# EAGLE design mds (EAGLE 7.3.0)
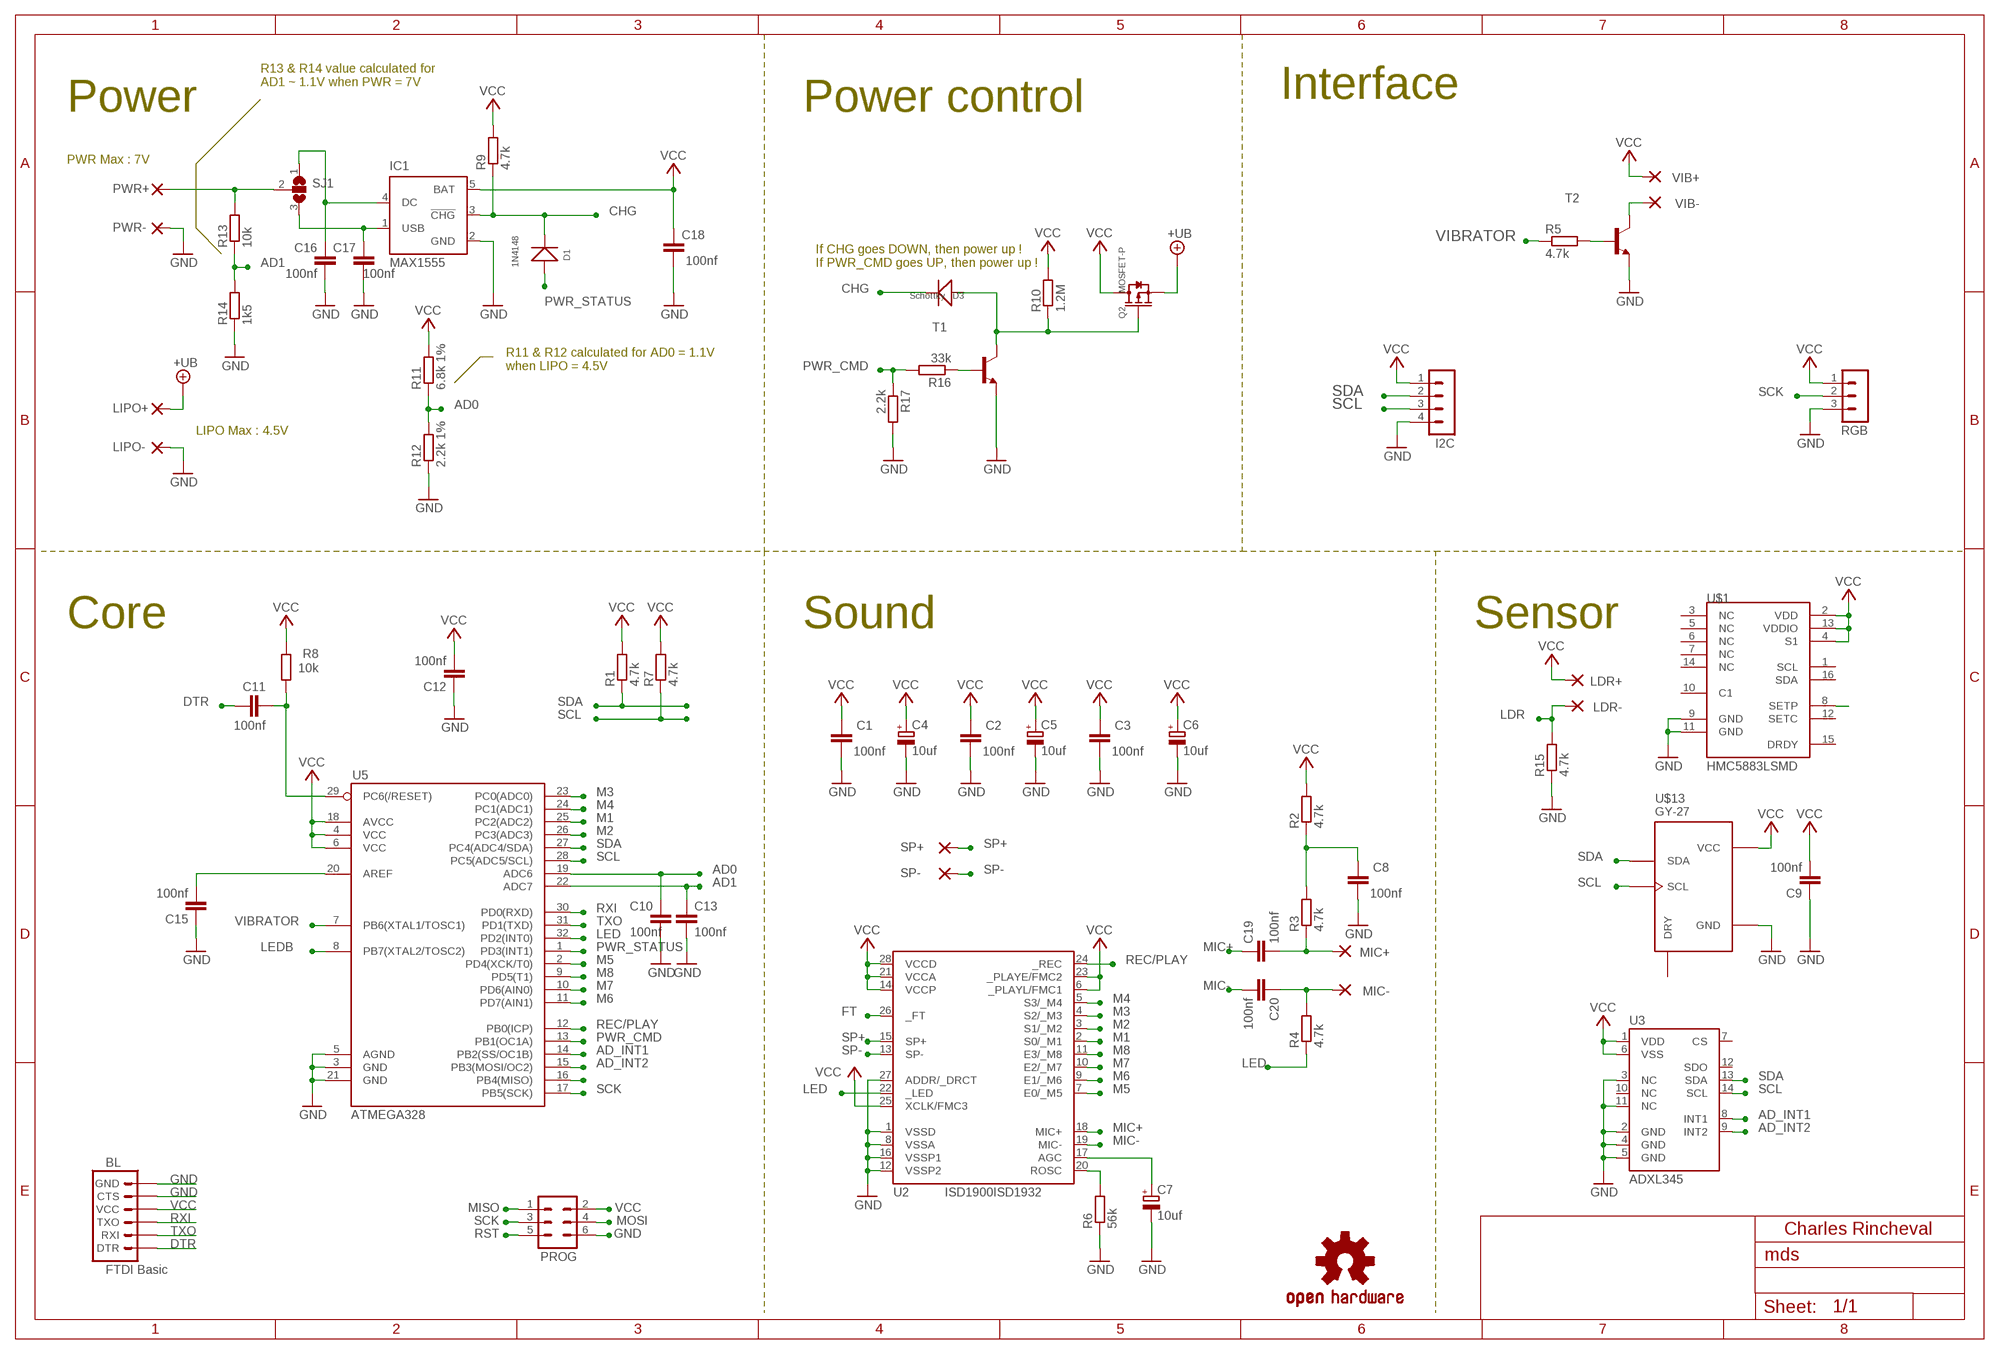
[diagram p0: schematic, sheet 1]

## Parts
BL  FTDI Basic  ARDUINO_SERIAL_PROGRAMPTH  [1X06]
C1  100nf  C-EUC0805  [C0805]
C2  100nf  C-EUC0805  [C0805]
C3  100nf  C-EUC0805  [C0805]
C4  10uf  CPOL-EUCT3528  [CT3528]
C5  10uf  CPOL-EUCT3528  [CT3528]
C6  10uf  CPOL-EUCT3528  [CT3528]
C7  10uf  CPOL-EUCT3528  [CT3528]
C8  100nf  C-EUC0805  [C0805]
C9  100nf  C-EUC0805  [C0805]
C10  100nf  C-EUC0805  [C0805]
C11  100nf  C-EUC0805  [C0805]
C12  100nf  C-EUC0805  [C0805]
C13  100nf  C-EUC0805  [C0805]
C15  100nf  C-EUC0805  [C0805]
C16  100nf  C-EUC0805  [C0805]
C17  100nf  C-EUC0805  [C0805]
C18  100nf  C-EUC0805  [C0805]
C19  100nf  C-EUC0805  [C0805]
C20  100nf  C-EUC0805  [C0805]
D1  1N4148  D-D1206  [LL-34]
D3  Schottky  D-D1206  [LL-34]
I2C  MA04-1  [MA04-1]
IC1  MAX1555  [SOT23-5L]
LDR+  1,6/0,8  [1,6/0,8]
LDR-  1,6/0,8  [1,6/0,8]
LIPO+  1,6/0,8  [1,6/0,8]
LIPO-  1,6/0,8  [1,6/0,8]
MIC+  1,6/0,8  [1,6/0,8]
MIC-  1,6/0,8  [1,6/0,8]
PROG  MA03-2  [MA03-2]
PWR+  1,6/0,8  [1,6/0,8]
PWR-  1,6/0,8  [1,6/0,8]
Q2  MOSFET-P  MOSFET-P-044021001  [SOT23]
R1  4.7k  R-EU_M0805  [M0805]
R2  4.7k  R-EU_M0805  [M0805]
R3  4.7k  R-EU_M0805  [M0805]
R4  4.7k  R-EU_M0805  [M0805]
R5  4.7k  R-EU_M0805  [M0805]
R6  56k  R-EU_M0805  [M0805]
R7  4.7k  R-EU_M0805  [M0805]
R8  10k  R-EU_M0805  [M0805]
R9  4.7k  R-EU_M0805  [M0805]
R10  1.2M  R-EU_M0805  [M0805]
R11  6.8k 1%  R-EU_M0805  [M0805]
R12  2.2k 1%  R-EU_M0805  [M0805]
R13  10k  R-EU_M0805  [M0805]
R14  1k5  R-EU_M0805  [M0805]
R15  4.7k  R-EU_M0805  [M0805]
R16  33k  R-EU_M0805  [M0805]
R17  2.2k  R-EU_M0805  [M0805]
RGB  MA03-1  [MA03-1]
SJ1  SJ2W  [SJ_2]
SP+  1,6/0,8  [1,6/0,8]
SP-  1,6/0,8  [1,6/0,8]
T1  MMBT2222ALT1-NPN-SOT23-BEC  [SOT23-BEC]
T2  MMBT2222ALT1-NPN-SOT23-BEC  [SOT23-BEC]
U2  ISD1900ISD1932  [SO-28W]
U3  ADXL345  [LGA14]
U5  ATMEGA328  ATMEGA168  [TQFP32-08]
U$1  HMC5883LSMD  [16LPCC]
U$13  GY-27  [GY-27]
U$14  OSHW-LOGOS  [OSHW-LOGO-S]
VIB+  1,6/0,8  [1,6/0,8]
VIB-  1,6/0,8  [1,6/0,8]

## Nets
+UB: LIPO+.1(P) Q2.2(S)
AD0: C10.1 R11.1 R12.2 U5.19(ADC6)
AD1: C13.1 R13.1 R14.2 U5.22(ADC7)
AD_INT1: U3.8(INT1) U5.14(PB2(SS/OC1B))
AD_INT2: U3.9(INT2) U5.15(PB3(MOSI/OC2))
AGC: C7.+ U2.17(AGC)
AREF: C15.2 U5.20(AREF)
CHG: D1.C(-) D3.C(-) IC1.3(!CHG) R9.1
DTR: BL.1(DTR) C11.1
FT: U2.26(_FT)
GND: BL.5(CTS) BL.6(GND) C1.1 C2.1 C3.1 C4.- C5.- C6.- C7.- C8.1 C9.1 C10.2 C12.1 C13.2 C15.1 C16.1 C17.1 C18.1 I2C.4 IC1.2(GND) LIPO-.1(P) PROG.6 PWR-.1(P) R6.1 R12.1 R14.1 R15.1 R17.2 RGB.3 T1.E T2.E U2.1(VSSD) U2.8(VSSA) U2.12(VSSP2) U2.16(VSSP1) U2.27(ADDR/_DRCT) U3.2(GND) U3.3(NC) U3.4(GND) U3.5(GND) U3.11(NC) U5.3(GND) U5.5(AGND) U5.21(GND) U$1.9(GND) U$1.11(GND) U$13.GND
LDR: LDR-.1(P) R15.2
LED: R4.1 U2.22(_LED) U5.32(PD2(INT0))
LEDB: U5.8(PB7(XTAL2/TOSC2))
M1: U2.2(S0/_M1) U5.25(PC2(ADC2))
M2: U2.3(S1/_M2) U5.26(PC3(ADC3))
M3: U2.4(S2/_M3) U5.23(PC0(ADC0))
M4: U2.5(S3/_M4) U5.24(PC1(ADC1))
M5: U2.7(E0/_M5) U5.2(PD4(XCK/T0))
M6: U2.9(E1/_M6) U5.11(PD7(AIN1))
M7: U2.10(E2/_M7) U5.10(PD6(AIN0))
M8: U2.11(E3/_M8) U5.9(PD5(T1))
MIC+: C19.1 U2.18(MIC+)
MIC-: C20.2 U2.19(MIC-)
MISO: PROG.1
MOSI: PROG.4
N$1: R6.2 U2.20(ROSC)
N$2: C19.2 MIC+.1(P) R3.1
N$3: C20.1 MIC-.1(P) R4.2
N$4: R16.1 T1.B
N$5: R5.2 T2.B
N$6: C8.2 R2.1 R3.2
N$7: T2.C VIB-.1(P)
N$8: PWR+.1(P) R13.2 SJ1.2
N$9: Q2.1(G) R10.1 T1.C
N$11: C17.2 IC1.1(USB) SJ1.3
N$12: C16.2 IC1.4(DC) SJ1.1
N$13: U5.16(PB4(MISO))
N$14: U$1.8(SETP)
PWR_CMD: R16.2 R17.1 U5.13(PB1(OC1A))
PWR_STATUS: D1.A(+) U5.1(PD3(INT1))
REC/PLAY: U2.24(_REC) U5.12(PB0(ICP))
RST: C11.2 PROG.5 R8.1 U5.29(PC6(/RESET))
RXI: BL.3(TXO) U5.30(PD0(RXD))
SCK: PROG.3 RGB.2 U5.17(PB5(SCK))
SCL: I2C.3 R7.1 U3.14(SCL) U5.28(PC5(ADC5/SCL)) U$13.SCL
SDA: I2C.2 R1.1 U3.13(SDA) U5.27(PC4(ADC4/SDA)) U$13.SDA
SP+: SP+.1(P) U2.15(SP+)
SP-: SP-.1(P) U2.13(SP-)
TXO: BL.2(RXI) U5.31(PD1(TXD))
VCC: BL.4(VCC) C1.2 C2.2 C3.2 C4.+ C5.+ C6.+ C9.2 C12.2 C18.2 I2C.1 IC1.5(BAT) LDR+.1(P) PROG.2 Q2.3(D) R1.2 R2.2 R7.2 R8.2 R9.2 R10.2 R11.2 RGB.1 U2.6(_PLAYL/FMC1) U2.14(VCCP) U2.21(VCCA) U2.23(_PLAYE/FMC2) U2.25(XCLK/FMC3) U2.28(VCCD) U3.1(VDD) U3.6(VSS) U5.4(VCC) U5.6(VCC) U5.18(AVCC) U$1.2(VDD) U$1.4(S1) U$1.13(VDDIO) U$13.VCC VIB+.1(P)
VIBRATOR: R5.1 U5.7(PB6(XTAL1/TOSC1))
Unconnected: D3.A(+) U3.7(CS) U3.10(NC) U3.12(SDO) U$1.1(SCL) U$1.3(NC) U$1.5(NC) U$1.6(NC) U$1.7(NC) U$1.10(C1) U$1.12(SETC) U$1.14(NC) U$1.15(DRDY) U$1.16(SDA) U$13.DRY

## Notes on the sheet
- R13 & R14 value calculated for
  AD1 ~ 1.1V when PWR = 7V
- Power | Power control | Interface
- PWR Max : 7V
- If CHG goes DOWN, then power up !
  If PWR_CMD goes UP, then power up !
- R11 & R12 calculated for AD0 = 1.1V
  when LIPO = 4.5V
- LIPO Max : 4.5V
- Core | Sound | Sensor
- Charles Rincheval

## Library data of the parts
BL = SparkFun:ARDUINO_SERIAL_PROGRAM
C1-C3 C8-C13 C15-C20 = rcl:C-EU: CAPACITOR, European symbol
C4-C7 = rcl:CPOL-EU: POLARIZED CAPACITOR, European symbol
D1 D3 = OPL Eagle Library:D*: DIODE
I2C = con-lstb:MA04-1: PIN HEADER; OC_FARNELL: unknown; OC_NEWARK: unknown
IC1 = maxim:MAX1555: Dual-Input USB/AC Adapter 1-Cell Li+ Battery Chargers Source: http://www.maxim-ic.com .. MAX1551-MAX1555.pdf; MF: MAXIM; MPN: MAX1555EZK+T; OC_FARNELL: 1628222; OC_NEWARK: 59J2761
LDR+ LDR- LIPO+ LIPO- MIC+ MIC- PWR+ PWR- SP+ SP- VIB+ VIB- = wirepad:1,6/0,8: THROUGH-HOLE PAD
PROG = con-lstb:MA03-2: PIN HEADER; OC_FARNELL: unknown; OC_NEWARK: unknown
Q2 = OPL Eagle Library:MOSFET-P: CJ2305：SMD MOSFET P-CH 8V-4.1A
R1-R17 = rcl:R-EU_: RESISTOR, European symbol
RGB = con-lstb:MA03-1: PIN HEADER; OC_FARNELL: unknown; OC_NEWARK: unknown
SJ1 = jumper:SJ2W: SMD solder JUMPER
T1 T2 = transistor-neu-to92:*-NPN-: NPN Transistror
U2 = SparkFun:ISD1900
U3 = SparkFun-Sensors:ADXL345: 3-axis SPI/I2C 2/4/8/16g accelerometer
U5 = SparkFun:ATMEGA168
U$1 = SparkFun-Sensors:HMC5883L: 3 Axis Digital Compass IC
U$13 = gy-27:GY-27
U$14 = SparkFun:OSHW-LOGO: Open Source Hardware Logo This logo indicates the piece of hardware it is found on incorporates a OSHW license and/or adheres to the definition of open source hardware found here: http://freedomdefined.org/OSHW

## Net classes
1 vcc: width 0.254 mm

## Board
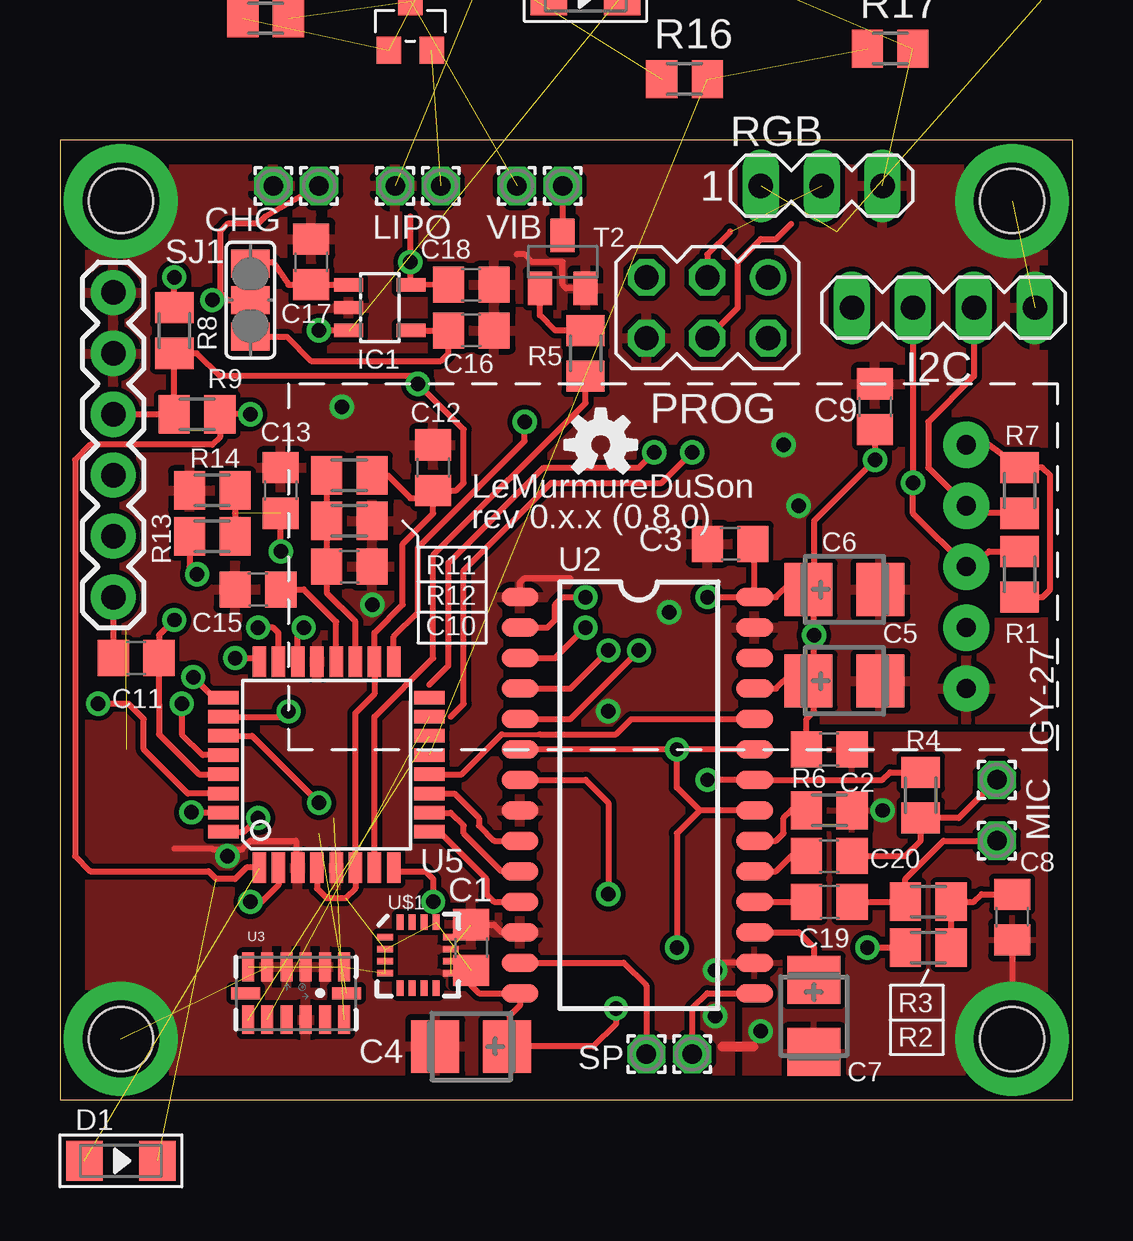
[diagram p1: board, top side]
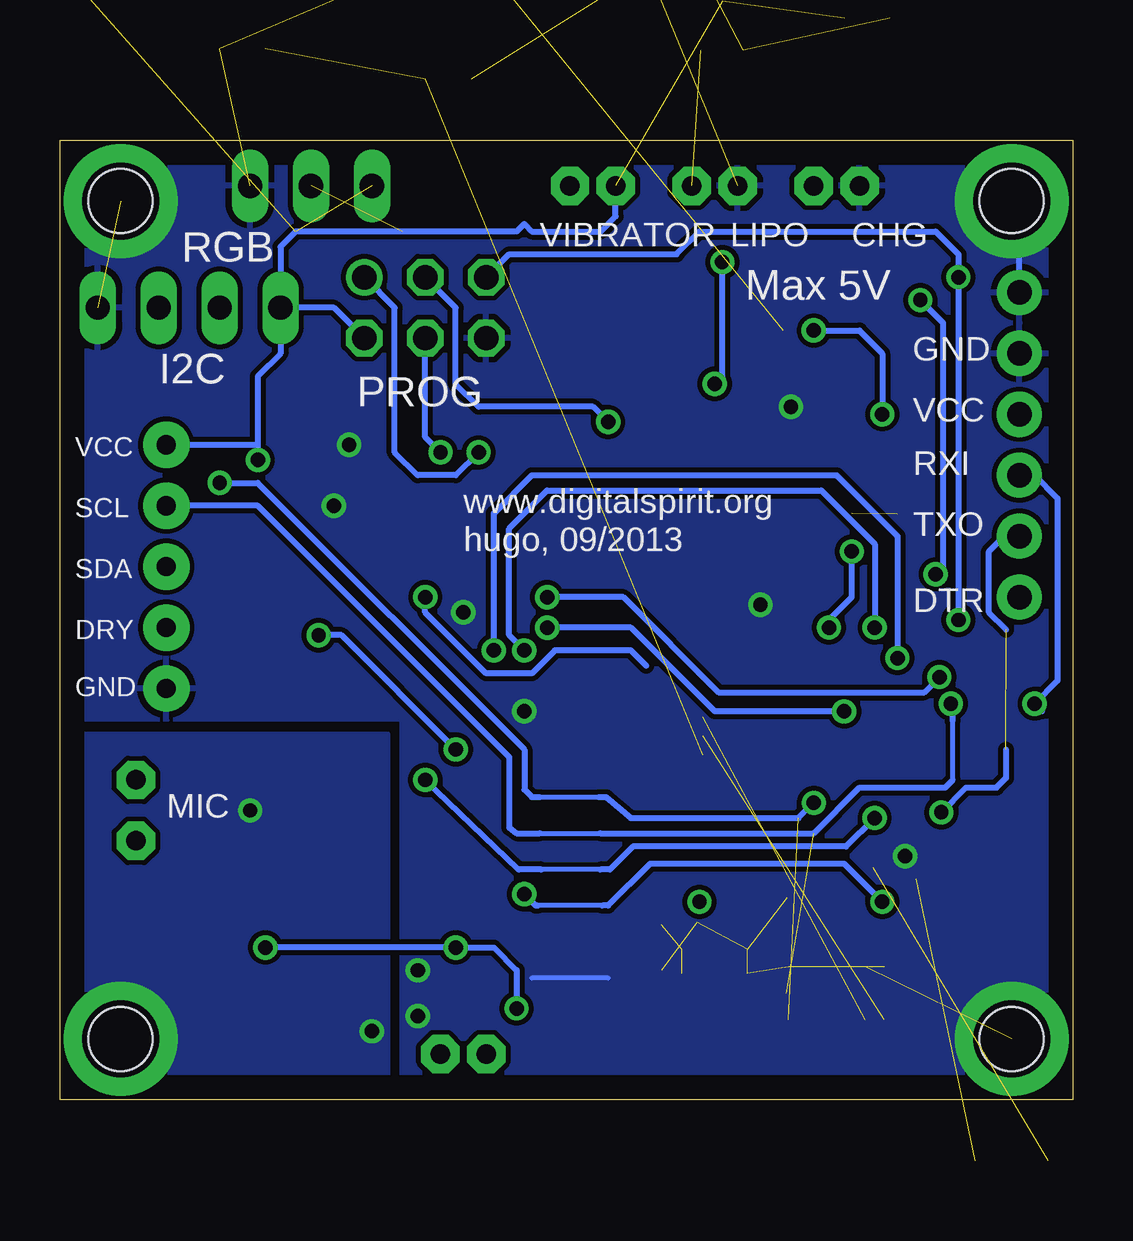
[diagram p2: board, bottom side, seen from below]

Size 42.22 x 39.99 mm. Coordinates in mm from the lower left corner, seen from the top.
Outline: 0,0 42.22,0 42.22,39.99 0,39.99 0,0
Copper layers (1*16): Top 0.035mm / dielectric 1.5mm / Bottom 0.035mm
Design rules "default": minimum track width 10mil, minimum drill 24mil, track to track 8mil, track to pad 8mil, pad to pad 8mil, via to via 8mil, smd to smd 8mil, copper to edge 40mil, drill to drill 8mil, minimum pad ring 10mil, minimum via ring 8mil, stop-mask expansion 4mil, vias tented up to drill 0mil, thermal gap 10mil
Holes 2.67 mm at 39.69,37.47 39.69,2.54 2.54,37.47 2.54,2.54

### Footprints (pad centres in the part's own frame; a part is rotated, then mirrored left to right if it is on the bottom)
1X06 = drill 1.016 pad 1.88: 1 0,0; 2 2.54,0; 3 5.08,0; 4 7.62,0; 5 10.16,0; 6 12.7,0
C0805 = smd 1.3 x 1.5: 1 -0.95,0; 2 0.95,0
CT3528 = smd 2 x 2.2: + -1.5,0; - 1.5,0
LL-34 = smd 1.524 x 1.676: A -1.524,0; C 1.524,0
MA04-1 = drill 1.016 long: 1 -3.81,0; 2 -1.27,0; 3 1.27,0; 4 3.81,0
SOT23-5L = smd 0.55 x 1.2: 1 -0.95,-1.3; 2 0,-1.3; 3 0.95,-1.3; 4 0.95,1.3; 5 -0.95,1.3
1,6/0,8 = drill 0.813 pad 1.6 octagon: 1 0,0
MA03-2 = drill 1.016: 1 -2.54,-1.27 | drill 1.016 octagon: 2 -2.54,1.27; 3 0,-1.27; 4 0,1.27; 5 2.54,-1.27; 6 2.54,1.27
SOT23 = smd 1.016 x 1.143: 1 -0.889,-1.016; 2 0.889,-1.016; 3 0,1.016
M0805 = smd 1.3 x 1.6: 1 -0.95,0; 2 0.95,0
MA03-1 = drill 1.016 long: 1 -2.54,0; 2 0,0; 3 2.54,0
SJ_2 = smd 1.168 x 1.6: 1 -1.524,0; 2 0,0; 3 1.524,0
SOT23-BEC = smd 1 x 1.4: B -0.95,-1.1; C 0,1.1; E 0.95,-1.1
SO-28W = smd 0.762 x 1.524: 1 -8.255,-4.953; 2 -6.985,-4.953; 3 -5.715,-4.953; 4 -4.445,-4.953; 5 -3.175,-4.953; 6 -1.905,-4.953; 7 -0.635,-4.953; 8 0.635,-4.953; 9 1.905,-4.953; 10 3.175,-4.953; 11 4.445,-4.953; 12 5.715,-4.953; 13 6.985,-4.953; 14 8.255,-4.953; 15 8.255,4.826; 16 6.985,4.826; 17 5.715,4.826; 18 4.445,4.826; 19 3.175,4.826; 20 1.905,4.826; 21 0.635,4.826; 22 -0.635,4.826; 23 -1.905,4.826; 24 -3.175,4.826; 25 -4.445,4.826; 26 -5.715,4.826; 27 -6.985,4.826; 28 -8.255,4.826
LGA14 = smd 0.5 x 1.2: 1 2,1.1; 2 1.2,1.1; 3 0.4,1.1; 4 -0.4,1.1; 5 -1.2,1.1; 6 -2,1.1; 8 -2,-1.1; 9 -1.2,-1.1; 10 -0.4,-1.1; 11 0.4,-1.1; 12 1.2,-1.1; 13 2,-1.1 | smd 1.2 x 0.5: 7 -2.1,0; 14 2.1,0
TQFP32-08 = smd 1.27 x 0.559: 1 -4.293,2.8; 2 -4.293,2; 3 -4.293,1.2; 4 -4.293,0.4; 5 -4.293,-0.4; 6 -4.293,-1.2; 7 -4.293,-2; 8 -4.293,-2.8; 17 4.293,-2.8; 18 4.293,-2; 19 4.293,-1.2; 20 4.293,-0.4; 21 4.293,0.4; 22 4.293,1.2; 23 4.293,2; 24 4.293,2.8 | smd 0.559 x 1.27: 9 -2.8,-4.293; 10 -2,-4.293; 11 -1.2,-4.293; 12 -0.4,-4.293; 13 0.4,-4.293; 14 1.2,-4.293; 15 2,-4.293; 16 2.8,-4.293; 25 2.8,4.293; 26 2,4.293; 27 1.2,4.293; 28 0.4,4.293; 29 -0.4,4.293; 30 -1.2,4.293; 31 -2,4.293; 32 -2.8,4.293
16LPCC = smd 0.65 x 0.28: 1 -1.37,0.75; 2 -1.37,0.25; 3 -1.37,-0.25; 4 -1.37,-0.75; 9 1.37,-0.75; 10 1.37,-0.25; 11 1.37,0.25; 12 1.37,0.75 | smd 0.28 x 0.65: 5 -0.75,-1.37; 6 -0.25,-1.37; 7 0.25,-1.37; 8 0.75,-1.37; 13 0.75,1.37; 14 0.25,1.37; 15 -0.25,1.37; 16 -0.75,1.37
GY-27 = drill 0.8 pad 1.93: DRY 3.81,10.16; GND 3.81,12.7; SCL 3.81,5.08; SDA 3.81,7.62; VCC 3.81,2.54

### Placement (x,y rotation side)
BL  2.22,20.95 90 top
C1  17.14,6.35 270 top
C2  32.07,14.61 180 top
C3  27.94,23.18 0 top
C4  17.14,2.22 180 top
C5  32.7,17.46 0 top
C6  32.7,21.27 0 top
C7  31.43,3.49 270 top
C8  39.69,7.62 90 top
C9  33.97,28.89 270 top
C10  12.06,22.23 0 top
C11  3.17,18.41 0 top
C12  15.56,26.35 270 top
C13  9.21,25.4 90 top
C15  8.26,21.27 0 top
C16  17.14,32.07 180 top
C17  10.48,34.92 270 top
C18  17.14,33.97 180 top
C19  32.07,8.26 0 top
C20  32.07,10.16 180 top
D1  2.54,-2.54 0 top
D3  21.91,46.04 0 top  (outside the outline)
I2C  36.83,33.02 0 top
IC1  13.34,33.02 270 top
LDR+  41.91,46.99 0 top  (outside the outline)
LDR-  36.83,47.94 0 top  (outside the outline)
LIPO+  15.88,38.1 0 top
LIPO-  13.97,38.1 0 top
MIC+  39.05,10.79 0 top
MIC-  39.05,13.34 0 top
PROG  26.99,33.02 180 top
PWR+  10.79,38.1 0 top
PWR-  8.89,38.1 0 top
Q2  14.61,44.77 0 top  (outside the outline)
R1  40.01,21.91 270 top
R2  36.2,6.35 180 top
R3  36.2,8.26 0 top
R4  35.88,12.7 270 top
R5  21.91,31.11 90 top
R6  32.07,12.06 180 top
R7  40.01,25.4 90 top
R8  4.76,32.07 270 top
R9  5.71,28.57 180 top
R10  8.57,45.09 0 top  (outside the outline)
R11  12.06,26.04 0 top
R12  12.06,24.13 180 top
R13  6.35,23.5 180 top
R14  6.35,25.4 0 top
R15  29.84,46.67 0 top  (outside the outline)
R16  26.04,42.55 0 top
R17  34.61,43.81 0 top  (outside the outline)
RGB  31.75,38.1 0 top
SJ1  7.94,33.34 90 top
SP+  26.35,1.91 0 top
SP-  24.45,1.91 0 top
T1  17.14,49.21 0 top  (outside the outline)
T2  20.95,34.92 0 top
U2  24.13,12.7 270 top
U3  9.84,4.45 0 top
U5  11.11,13.97 90 top
U$1  14.92,6.03 0 top
U$13  41.59,29.84 180 top
U$14  22.54,27.3 0 top
VIB+  19.05,38.1 0 top
VIB-  20.95,38.1 0 top

### Tracks (layer width: path | path; a pad name or v marks a point on that pad's centre or on a via)
+UB  (1 unrouted)
AD0
  Top 0.254: U5.19 12.31,19.93 11.12,21.13 C10.1 R12.2 R11.1
AD1  (via drill 0.6)  (1 unrouted)
  Top 0.254: R14.2 7.3,24.45 | 7.3,24.45 R13.1 | 7.3,24.45 | U5.22 9.91,19.44 v10.16,19.68 | v9.21,22.86 C13.1
  Bottom 0.254: v10.16,19.68 10.16,20 9.21,20.95 v9.21,22.86
AD_INT1  (1 unrouted)
AD_INT2  (1 unrouted)
AGC
  Top 0.254: U2.17 30.8,6.99 31.43,6.35 C7.+
AREF
  Top 0.254: C15.2 10.16,21.27 11.51,19.92 U5.20
CHG  (via drill 0.6, 0.6 pad 1.02)  (2 unrouted)
  Top 0.254: IC1.3 12.06,32.07 v10.79,32.07 | R9.1 | v7.94,28.57 R9.1 | R9.1 6.67,27.62 6.35,27.3 1.27,27.3 0.64,26.67 0.64,10.16 1.27,9.53 6.19,9.53 6.51,9.2 7.3,9.2 7.78,9.68 8.1,9.68
  Bottom 0.254: v10.79,32.07 8.89,32.07 7.94,31.11 v7.94,28.57
DTR
  Top 0.254: BL.1 2.22,18.73 C11.1
GND  (via drill 0.6 pad 1.02, 3.2 pad 4.75)  (7 unrouted)
  Top 0.254: U2.1 19.18,21.56 19.37,21.75 21.27,21.75 | C1.1 18.1,7.3 18.41,6.99 U2.12 | U2.16 27.3,5.71 | T2.E 21.1,33.83 20.95,33.97 20.95,34.92 19.68,34.92 19.37,35.24 19.05,35.24 | 4.76,10.48 6.35,10.48 6.39,10.44 7.58,10.44 7.94,10.79 9.84,10.79 9.84,9.75 U5.3 | C8.1 v39.69,2.54
  Top 0.406: 27.62,2.22 28.89,2.22
  Bottom 0.203: 19.37,5.08 22.54,5.08
  Bottom 0.254: BL.6 2.22,37.15 v2.54,37.47
  other vias: 34.29,12.06 30.8,24.77 30.16,27.3 29.21,2.86 25.4,20.32 11.75,28.89 27.3,3.49 27.3,5.4 13.02,20.64 22.86,16.19 6.99,10.16 2.54,2.54 39.69,37.47
  pour Top (isolate 0.025): 0.32,39.69 0.32,0.32 27.94,0.32 27.94,15.88 41.91,15.88 41.91,39.69
  pour Bottom (isolate 0.025): 0.32,0.32 27.94,0.32 27.94,15.88 41.91,15.88 41.91,39.69 0.32,39.69
  pour Top: 28.57,0.32 28.57,15.24 41.91,15.24 41.91,0.32
  pour Bottom: 28.57,0.32 41.91,0.32 41.91,15.24 28.57,15.24
LDR  (1 unrouted)
LED  (via drill 0.6, 0.6 pad 1.02)
  Top 0.254: 29.21,13.34 U2.22 | U2.22 34.29,13.34 34.61,13.65 35.56,13.65 R4.1 | U2.22 v26.99,13.34 | U5.32 7.68,11.17 v8.26,11.75 8.31,11.8
  Bottom 0.203: 19.68,9.6 22.15,9.6
  Bottom 0.254: v8.26,11.75 9.45,10.56 18.34,10.56 19.29,9.6 19.68,9.6 | 22.15,9.6 23.1,9.6 v26.99,13.34
LEDB  (via drill 0.6)
  Top 0.254: U5.8 13.97,9.53 15.24,9.53 15.56,9.21 v15.56,8.26
M1  (via drill 0.6, 0.6 pad 1.02)
  Top 0.254: U2.2 20.32,19.68 20.64,20 20.64,20.64 20.95,20.95 v21.91,20.95 | U5.25 6.41,16.77 v5.56,17.62
  Bottom 0.254: v21.91,20.95 18.73,20.95 14.76,16.99 6.19,16.99 v5.56,17.62
M2  (via drill 0.6, 0.6 pad 1.02)
  Top 0.254: U2.3 20.64,18.41 v21.91,19.68 | U5.26 9.3,15.97 v9.53,16.19
  Bottom 0.254: v9.53,16.19 14.92,16.19 18.41,19.68 v21.91,19.68
M3  (via drill 0.6)
  Top 0.254: 19.37,17.14 21.27,17.14 v22.86,18.73 | U5.23 9.11,19.46 8.89,19.68 v8.26,19.68
  Top 0.406: U2.4 19.37,17.14
  Bottom 0.254: v22.86,18.73 23.5,19.37 23.5,23.81 21.91,25.4 10.48,25.4 8.26,23.18 v8.26,19.68
M4  (via drill 0.6)
  Top 0.254: U2.5 21.27,15.88 v24.13,18.73 | v7.3,18.41 8.26,18.41 8.26,18.32 U5.24
  Bottom 0.254: v24.13,18.73 24.13,24.45 22.54,26.04 9.84,26.04 7.3,23.5 v7.3,18.41
M5  (via drill 0.6, 0.6 pad 1.02)
  Top 0.254: U2.7 21.91,13.34 22.86,12.38 v22.86,8.57 | U5.2 9.11,8.95 8.41,8.26 v7.94,8.26
  Bottom 0.203: 19.61,8.1 22.3,8.1
  Bottom 0.254: v7.94,8.26 9.53,9.84 17.62,9.84 19.37,8.1 19.61,8.1 | 22.3,8.1 22.38,8.1 v22.86,8.57
M6
  Top 0.254: U5.11 16.44,12.77 17.46,11.75 17.46,11.43 18.1,10.79 U2.9 18.73,10.79
M7
  Top 0.254: U5.10 16.29,11.97 16.83,11.43 16.83,11.11 18.41,9.53 U2.10
M8
  Top 0.254: U5.9 15.72,11.27 17.78,9.21 17.78,8.57 18.1,8.26 U2.11 19.37,8.26
MIC+
  Top 0.254: U2.18 C19.1
MIC-
  Top 0.254: U2.19 29.84,9.53 30.48,10.16 C20.2
MISO  (via drill 0.6 pad 1.02)
  Top 0.254: v24.77,26.99 24.13,26.35 20.16,26.35 16.19,22.38 16.19,18.1 15.4,17.31
  Bottom 0.254: v24.77,26.99 25.72,26.04 27.3,26.04 28.26,26.99 28.26,33.02 PROG.1
MOSI  (via drill 0.6 pad 1.02)
  Top 0.254: v26.35,26.99 25.08,25.72 20.48,25.72 16.83,22.07 16.83,16.51 16.29,15.97 | PROG.4 28.26,33.02 28.26,34.92 29.21,35.88 29.84,35.88 30.48,36.51
  Bottom 0.254: v26.35,26.99 26.99,27.62 PROG.4
N$1
  Top 0.254: U2.20 29.84,10.79 30.16,11.11 30.16,11.75 30.48,12.06 R6.2
N$2
  Top 0.254: C19.2 R3.1 35.24,9.21 36.83,10.79 MIC+.1
N$3
  Top 0.254: C20.1 35.24,10.16 35.88,10.79 R4.2 35.56,11.75 37.47,11.75 MIC-.1
N$4  (1 unrouted)
N$5
  Top 0.254: R5.2 20.64,32.07 20,32.7 20,33.19 T2.B
N$6
  Top 0.254: C8.2 40,8.57 38.42,8.57 38.1,8.25 37.78,8.25 R3.2 R2.1
N$7
  Top 0.254: VIB-.1 T2.C
N$8  (via drill 0.6)
  Top 0.254: 6.67,33.66 6.67,36.2 6.99,36.51 8.26,36.51 8.57,36.83 PWR+.1 | 6.67,33.66 6.99,33.34 SJ1.2 | R13.2 5.4,22.22 v5.71,21.91 | v6.35,33.34 6.67,33.66
  Bottom 0.254: v5.71,21.91 5.4,22.23 5.4,32.38 v6.35,33.34
N$9  (2 unrouted)
N$11
  Top 0.254: SJ1.3 8.26,34.92 8.89,34.92 9.53,33.97 10.16,33.97 10.41,33.91 C17.2 12.38,33.98 11.75,33.97 IC1.1
N$12
  Top 0.254: SJ1.1 9.46,31.81 10.48,30.8 15.88,30.8 16.19,31.11 16.19,32.04 IC1.4 15.88,32.07 C16.2
PWR_CMD  (2 unrouted)
PWR_STATUS  (1 unrouted)
REC/PLAY
  Top 0.203: 18.41,15.24 20,15.24
  Top 0.254: 20,15.24 23.18,15.24 23.81,15.88 U2.24 | U5.12 16.75,13.57 18.41,15.24
RST  (via drill 0.6)
  Top 0.254: R8.1 v4.76,34.29 | U5.29 5.8,13.57 4.13,15.24 4.13,16.51 C11.2 4.13,19.37 v4.76,20
  Bottom 0.254: v4.76,20 v4.76,34.29 4.76,35.24 5.71,36.2 15.56,36.2 16.51,35.24 23.5,35.24 PROG.5
RXI  (via drill 0.6)
  Top 0.254: U5.30 5.33,12.77 3.49,14.61 3.49,15.88 2.86,16.51 v1.59,16.51
  Bottom 0.254: BL.3 1.59,26.04 0.64,25.08 0.64,17.46 v1.59,16.51 1.27,16.19
SCK  (via drill 0.6 pad 1.02)  (1 unrouted)
  Top 0.254: v19.37,28.26 19.37,27.46 14.92,23.02 14.92,20.32 13.91,19.31 U5.17 | 27.94,36.2 26.99,35.24 PROG.3
  Bottom 0.254: v19.37,28.26 20,28.89 24.77,28.89 25.72,29.84 25.72,33.02 PROG.3
SCL  (via drill 0.6)  (1 unrouted)
  Top 0.254: I2C.3 38.1,30.16 36.2,28.26 36.2,26.35 U$13.SCL 38.1,24.45 R7.1 | v5.08,16.51 5.08,15.24 5.95,14.37 U5.28
  Bottom 0.203: 22.23,11.11 19.68,11.11 | 5,13.34 5,15.8
  Bottom 0.254: U$13.SCL 33.97,24.77 23.5,14.29 23.5,11.35 23.18,11.11 22.23,11.11 | 19.68,11.11 10.79,11.11 8.89,13.02 5.32,13.02 5,13.34 | 5,15.8 5,16.43 v5.08,16.51
SDA  (via drill 0.6)  (1 unrouted)
  Top 0.254: I2C.2 v35.56,25.72 35.56,24.45 U$13.SDA 38.73,22.86 R1.1 | R1.1 | R1.1 | U5.27 8.01,15.17 v10.79,12.38
  Bottom 0.203: 22.23,12.62 19.76,12.62
  Bottom 0.254: v35.56,25.72 33.97,25.72 22.86,14.61 22.86,12.94 22.54,12.62 22.23,12.62 | 19.76,12.62 19.45,12.62 18.41,11.75 11.43,11.75 v10.79,12.38
SP+
  Top 0.254: U2.15 26.99,4.45 26.35,3.81 SP+.1
SP-
  Top 0.254: U2.13 23.5,5.71 24.45,4.76 SP-.1
TXO  (via drill 0.6)  (1 unrouted)
  Top 0.254: U5.31 5.49,11.97 v5.48,11.99
  Bottom 0.254: 2.77,19.6 3.49,20.32 3.49,22.86 2.86,23.5 BL.2 | 2.78,14.6 2.78,13.41 3.17,13.02 4.45,13.02 v5.48,11.99
VCC  (via drill 0.6, 0.6 pad 1.02)  (10 unrouted)
  Top 0.254: C18.2 15.91,33.97 IC1.5 14.61,34 v14.61,34.92 14.61,36.83 | U2.23 v25.72,14.61 | v25.72,14.61 U2.6 | v25.72,6.35 25.72,11.11 26.67,12.06 | U2.28 29.84,20.95 30.48,21.59 C6.+ | U2.28 28.96,23.11 C3.2 | U2.25 29.84,17.14 30.48,17.78 C5.+ | C2.2 31.12,15.88 31.43,16.19 31.43,17.38 C5.+ | C5.+ 31.43,17.78 v31.43,19.37 31.43,20.87 | 31.43,20.87 C6.+ | 31.43,20.87 31.43,24.13 v33.97,26.67 C9.2 | 31.75,21.36 C6.+ | C12.2 15.56,24.45 14.29,23.18 14.29,20.64 13.11,19.46 U5.18 13.11,16.92 12.31,16.12 U5.6 12.31,8.82 11.91,8.41 11.11,8.41 10.71,8.81 | C12.2 16.51,25.4 16.83,25.72 16.83,27.94 v14.92,29.84 14.61,30.16 6.67,30.16 5.71,31.11 4.45,31.11 R8.2 R9.2 BL.4 | R1.2 40.96,20.96 41.27,21.27 41.27,26.04 40.96,26.35 R7.2 38.74,27.3 U$13.VCC | v33.66,6.35 R2.2 | U2.21 26.67,12.06 | 26.67,12.06 25.72,13.02 v25.72,14.61 | v23.18,3.81 23.18,3.17 22.23,2.22 C4.+ 18.73,2.31 18.73,3.49 19.18,3.94 U2.14 17.46,4.45 17.14,4.76 C1.2 | R11.2 13.65,26.04 14.61,25.08 15.24,25.08 C12.2 | U5.4 10.71,8.81 | v26.99,20.95 U2.28 | 10.71,8.81
  Bottom 0.254: v14.92,29.84 14.61,30.16 v14.61,34.92 | v25.72,14.61 30.48,19.37 v31.43,19.37 | PROG.2 30.8,33.02 I2C.1 | I2C.1 33.02,31.11 33.97,30.16 33.97,27.3 | 33.97,27.3 v33.97,26.67 | U$13.VCC 33.97,27.3 | v33.66,6.35 v25.72,6.35 24.13,6.35 23.18,5.4 v23.18,3.81 | VIB+.1 19.05,36.83 19.68,36.2 22.54,36.2 22.86,36.51 23.18,36.2 32.38,36.2 33.02,35.56 I2C.1 | 17.77,18.09 18.41,18.73 21.59,18.73 22.54,17.78 24.45,17.78 26.99,20.32 v26.99,20.95
VIBRATOR
  Top 0.254: R5.1 21.91,29.05 15.56,22.7 15.56,18.41 13.11,15.97 U5.7

### Text on the board
tNames: CHG | LIPO | VIB | LeMurmureDuSon | rev 0.x.x (0.8.0) | MIC | SP
bNames: CHG | LIPO | VIBRATOR | RGB | Max 5V | GND | I2C | PROG | VCC | VCC | RXI | www.digitalspirit.org | SCL | TXO | hugo, 09/2013 | SDA | DTR | DRY | GND | MIC